# EasyEDA schematic AD8232_.json
TITLE: Sheet_1; REV: 1.0; Date: 2022-02-10; Sheet: 1/1; Drawn By: imamjheimam27; Company: Your Company
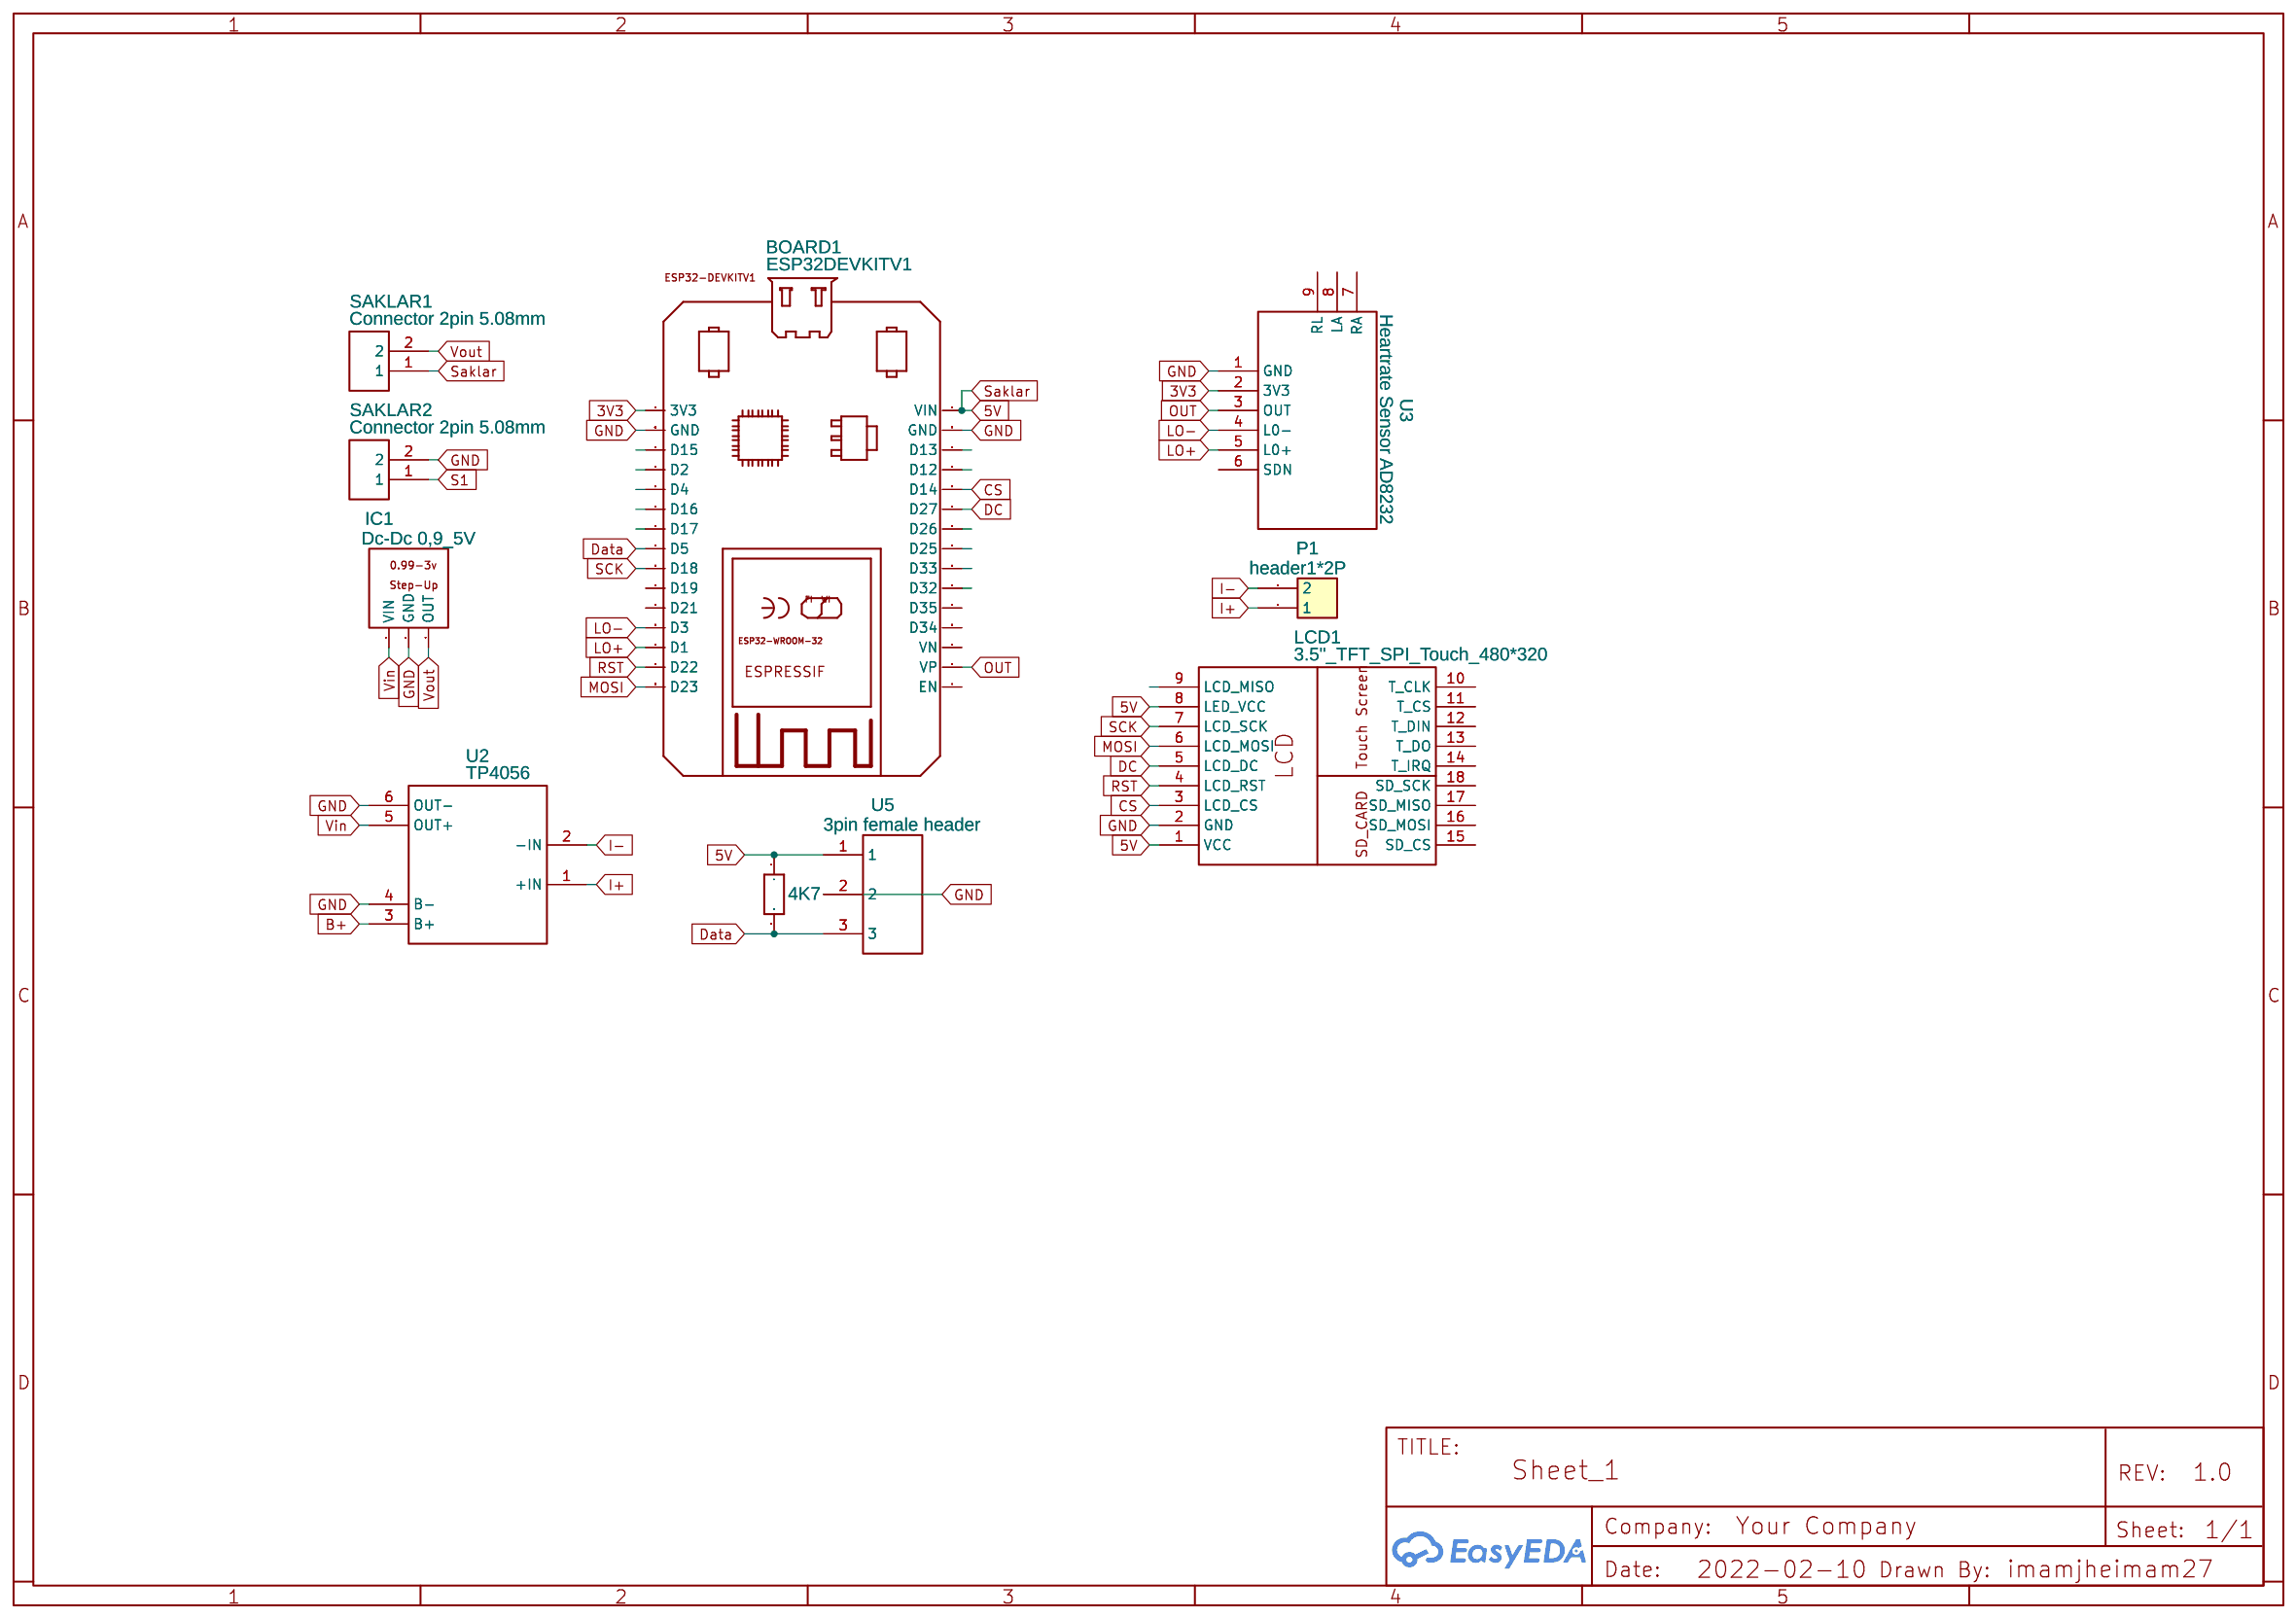
[diagram p0: schematic sheet]

## Parts
4K7  .  [RESAD1750W63L750D250]
BOARD1  ESP32DEVKITV1  [ESP32-DEVKITV1]
IC1  Dc-Dc 0,9_5V  [DC-DC 0.9_5V]
LCD1  3.5"_TFT_SPI_Touch_480*320  [TOUCHSCREEN ILI9488 3.5" TFT SPI 480X320 V1.0 COPY]
P1  header1*2P  [2PIN-HEADER]
SAKLAR1  Connector 2pin 5.08mm  [CONNECTOR  2PIN 5.08MM]
SAKLAR2  Connector 2pin 5.08mm  [CONNECTOR  2PIN 5.08MM]
U2  TP4056  [TP4056]
U3  Heartrate Sensor AD8232  [HEARTRATE SENSOR AD8232]
U5  3pin female header  [3PIN FEMALE HEADER]

## Library data of the parts
4K7 = NFR25H0002208J: Contributor: mrmagpie
BOARD1 = ESP32DEVKITV1: Contributor: sino
IC1 = Dc-Dc 0,9_5V: Contributor: emiliopisa
LCD1 = 3.5&quot;_TFT_SPI_Touch_480*320: Manufacturer Part: ILI 9488; link: http://www.lcdwiki.com/3.5inch_SPI_Module_ILI9488_SKU:MSP3520; Contributor: Andrei GURSCHI
P1 = header1*2P: Contributor: al.levashov
SAKLAR1 SAKLAR2 = Connector 2pin 5.08mm: Contributor: bulyga
U2 = TP4056: Contributor: Manuel Velásquez
U3 = Heartrate Sensor AD8232: Contributor: allvex
U5 = 3pin female header: link: https://a.pololu-files.com/picture/0J880.1200.jpg?97bf8a1d9d7fd4e66a3c71ca1c7a873e; Contributor: stentz

## Nets
3V3: BOARD1.3V3 U3.2(3V3)
5V: 4K7.1 BOARD1.VIN LCD1.1(VCC) LCD1.8(LED_VCC) SAKLAR1.1 U5.1
GND: BOARD1.GND BOARD1.GND@1(GND) IC1.2(GND) LCD1.2(GND) SAKLAR2.2 U2.4(B-) U2.6(OUT-) U3.1(GND) U5.2
Vin: IC1.1(VIN) U2.5(OUT+)
B+: U2.3(B+)
CS: BOARD1.D14 LCD1.3(LCD_CS)
Data: 4K7.2 BOARD1.D5 U5.3
DC: BOARD1.D27 LCD1.5(LCD_DC)
I+: P1.1 U2.1(+IN)
I-: P1.2 U2.2(-IN)
LO+: BOARD1.D1 U3.5(L0+)
LO-: BOARD1.D3 U3.4(L0-)
MOSI: BOARD1.D23 LCD1.6(LCD_MOSI)
OUT: BOARD1.VP U3.3(OUT)
RST: BOARD1.D22 LCD1.4(LCD_RST)
S1: SAKLAR2.1
SCK: BOARD1.D18 LCD1.7(LCD_SCK)
Vout: IC1.3(OUT) SAKLAR1.2

Not connected (* = marked no-connect by the designer): BOARD1 D2 D4 D12 D13 D15 D16 D17 D19 D21 D25 D26 D32 D33 D34 D35 EN VN; LCD1 9(LCD_MISO) 10(T_CLK) 11(T_CS) 12(T_DIN) 13(T_DO) 14(T_IRQ) 15(SD_CS) 16(SD_MOSI) 17(SD_MISO) 18(SD_SCK); U3 6(SDN) 7(RA) 8(LA) 9(RL)
